# Altium schematic sheet Connector Section.SchDoc
size A; DocumentNumber: 5; SheetNumber: 5; SheetTotal: 16
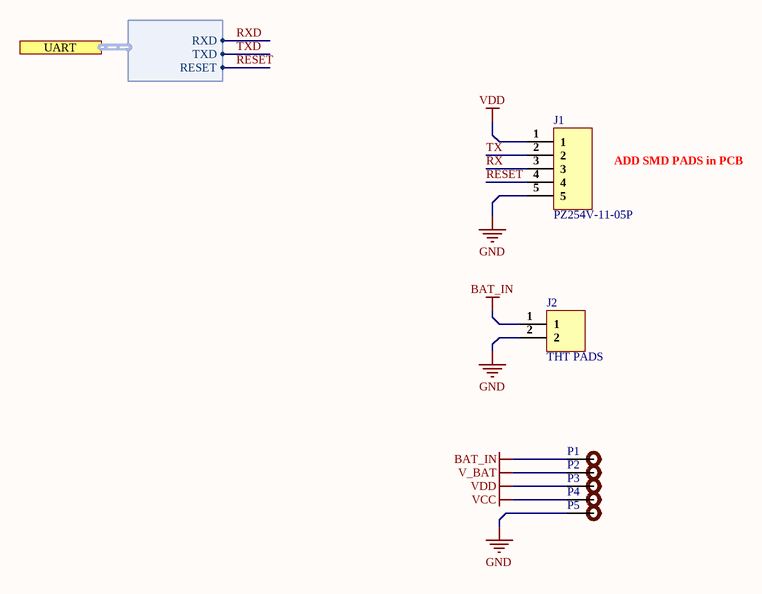
[diagram p0: Connector Section.SchDoc]

## Parts
J1  PZ254V-11-05P  [PZ254V-11-05P]
J2  THT PADS  [THT PAD]
P1  Test Point  [TEST POINT]  (value not drawn)
P2  Test Point  [TEST POINT]  (value not drawn)
P3  Test Point  [TEST POINT]  (value not drawn)
P4  Test Point  [TEST POINT]  (value not drawn)
P5  Test Point  [TEST POINT]  (value not drawn)

## Ports
UART (harness OSC)

## Harnesses
OSC: RXD, TXD, RESET

## Nets
BAT_IN: J2.1 P1.1
GND: J1.5 J2.2 P5.1
V_BAT: P2.1
VCC: P4.1
VDD: J1.1 P3.1
RESET: J1.4 ; port UART.RESET
RX: J1.3
RXD: port UART.RXD
TX: J1.2
TXD: port UART.TXD

## Notes on the sheet
- ADD SMD PADS in PCB

## Library data of the parts
J1 = PZ254V-11-05P: Pin Header 5 1 right-angle; Manufacturer: XFCN; Brand Category: Made In Asia Brands; Pitch: 2.54; Packaging: Bag-packed; Connector Type: Pin Header; Number of Pins: 5; Number of Rows: 1
J2 = THT PAD
P1-P5 = TEST POINT: Test Point ON